# EAGLE design din-rail-distributor (EAGLE 7.3.0)
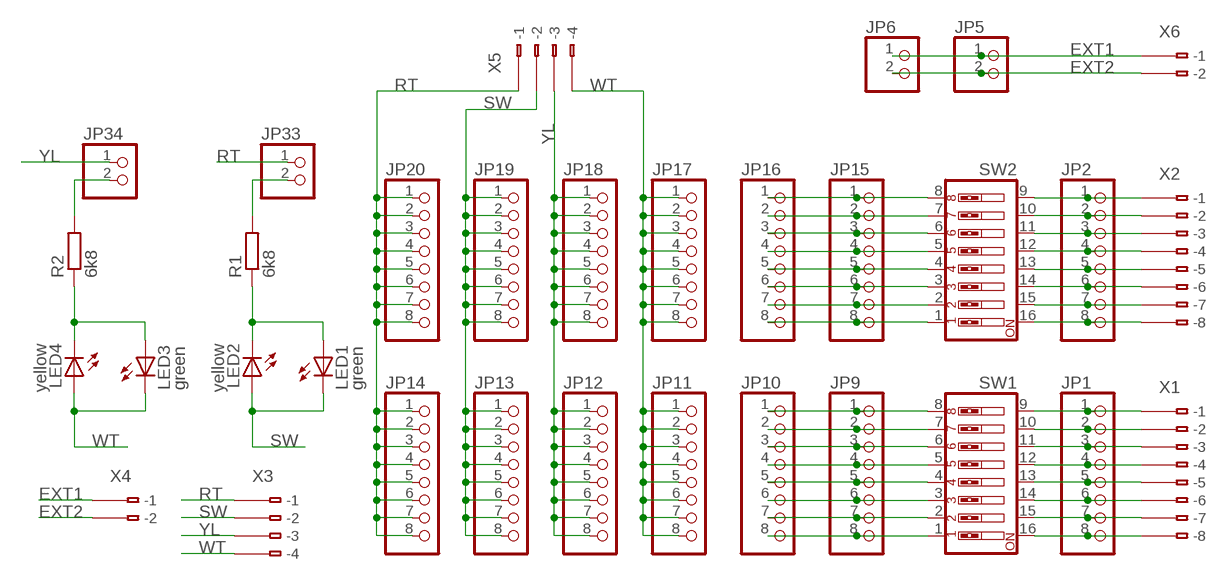
[diagram p0: schematic, sheet 1]

## Parts
JP1  PINHD-1X8  [1X08]
JP2  PINHD-1X8  [1X08]
JP5  PINHD-1X2  [1X02]
JP6  PINHD-1X2  [1X02]
JP9  PINHD-1X8/SMALL  [1X08/SMALL]
JP10  PINHD-1X8/SMALL  [1X08/SMALL]
JP11  PINHD-1X8/SMALL  [1X08/SMALL]
JP12  PINHD-1X8/SMALL  [1X08/SMALL]
JP13  PINHD-1X8/SMALL  [1X08/SMALL]
JP14  PINHD-1X8/SMALL  [1X08/SMALL]
JP15  PINHD-1X8/SMALL  [1X08/SMALL]
JP16  PINHD-1X8/SMALL  [1X08/SMALL]
JP17  PINHD-1X8/SMALL  [1X08/SMALL]
JP18  PINHD-1X8/SMALL  [1X08/SMALL]
JP19  PINHD-1X8/SMALL  [1X08/SMALL]
JP20  PINHD-1X8/SMALL  [1X08/SMALL]
JP33  PINHD-1X2  [1X02]
JP34  PINHD-1X2  [1X02]
LED1  green  LEDCHIP-LED0603  [CHIP-LED0603]
LED2  yellow  LEDCHIP-LED0603  [CHIP-LED0603]
LED3  green  LEDCHIP-LED0603  [CHIP-LED0603]
LED4  yellow  LEDCHIP-LED0603  [CHIP-LED0603]
R1  6k8  R-EU_R1206  [R1206]
R2  6k8  R-EU_R1206  [R1206]
SW1  SW_DIP-8  [EDG-08]
SW2  SW_DIP-8  [EDG-08]
X1  233-108  [233-108]
X2  233-108  [233-108]
X3  233-104  [233-104]
X4  233-102  [233-102]
X5  233-104  [233-104]
X6  233-102  [233-102]

## Nets
EXT1: JP5.1 JP6.1 X4.B1(B-1) X6.B1(B-1)
EXT2: JP5.2 JP6.2 X4.B2(B-2) X6.B2(B-2)
N$1: JP1.8 SW1.16 X1.B8(B-8)
N$2: JP1.7 SW1.15 X1.B7(B-7)
N$3: JP1.6 SW1.14 X1.B6(B-6)
N$4: JP1.5 SW1.13 X1.B5(B-5)
N$5: JP1.4 SW1.12 X1.B4(B-4)
N$6: JP1.3 SW1.11 X1.B3(B-3)
N$7: JP1.2 SW1.10 X1.B2(B-2)
N$8: JP1.1 SW1.9 X1.B1(B-1)
N$9: JP2.8 SW2.16 X2.B8(B-8)
N$10: JP2.7 SW2.15 X2.B7(B-7)
N$11: JP2.6 SW2.14 X2.B6(B-6)
N$12: JP2.5 SW2.13 X2.B5(B-5)
N$13: JP2.4 SW2.12 X2.B4(B-4)
N$14: JP2.3 SW2.11 X2.B3(B-3)
N$15: JP2.2 SW2.10 X2.B2(B-2)
N$16: JP2.1 SW2.9 X2.B1(B-1)
N$49: JP15.1 JP16.1 SW2.8
N$50: JP15.2 JP16.2 SW2.7
N$51: JP15.3 JP16.3 SW2.6
N$52: JP15.4 JP16.4 SW2.5
N$53: JP15.5 JP16.5 SW2.4
N$54: JP15.6 JP16.6 SW2.3
N$55: JP15.7 JP16.7 SW2.2
N$56: JP15.8 JP16.8 SW2.1
N$57: JP9.1 JP10.1 SW1.8
N$58: JP9.2 JP10.2 SW1.7
N$59: JP9.3 JP10.3 SW1.6
N$60: JP9.4 JP10.4 SW1.5
N$61: JP9.5 JP10.5 SW1.4
N$62: JP9.6 JP10.6 SW1.3
N$63: JP9.7 JP10.7 SW1.2
N$64: JP9.8 JP10.8 SW1.1
N$66: JP33.2 R1.2
N$67: LED1.A LED2.C R1.1
N$68: JP34.2 R2.2
N$69: LED3.A LED4.C R2.1
RT: JP14.1 JP14.2 JP14.3 JP14.4 JP14.5 JP14.6 JP14.7 JP14.8 JP20.1 JP20.2 JP20.3 JP20.4 JP20.5 JP20.6 JP20.7 JP20.8 JP33.1 X3.B1(B-1) X5.B1(B-1)
SW: JP13.1 JP13.2 JP13.3 JP13.4 JP13.5 JP13.6 JP13.7 JP13.8 JP19.1 JP19.2 JP19.3 JP19.4 JP19.5 JP19.6 JP19.7 JP19.8 LED1.C LED2.A X3.B2(B-2) X5.B2(B-2)
WT: JP11.1 JP11.2 JP11.3 JP11.4 JP11.5 JP11.6 JP11.7 JP11.8 JP17.1 JP17.2 JP17.3 JP17.4 JP17.5 JP17.6 JP17.7 JP17.8 LED3.C LED4.A X3.B4(B-4) X5.B4(B-4)
YL: JP12.1 JP12.2 JP12.3 JP12.4 JP12.5 JP12.6 JP12.7 JP12.8 JP18.1 JP18.2 JP18.3 JP18.4 JP18.5 JP18.6 JP18.7 JP18.8 JP34.1 X3.B3(B-3) X5.B3(B-3)
Unconnected: X1.A1(-1) X1.A2(-2) X1.A3(-3) X1.A4(-4) X1.A5(-5) X1.A6(-6) X1.A7(-7) X1.A8(-8) X2.A1(-1) X2.A2(-2) X2.A3(-3) X2.A4(-4) X2.A5(-5) X2.A6(-6) X2.A7(-7) X2.A8(-8) X3.A1(-1) X3.A2(-2) X3.A3(-3) X3.A4(-4) X4.A1(-1) X4.A2(-2) X5.A1(-1) X5.A2(-2) X5.A3(-3) X5.A4(-4) X6.A1(-1) X6.A2(-2)

## Library data of the parts
JP1 JP2 JP9-JP20 = pinhead:PINHD-1X8: PIN HEADER
JP5 JP6 JP33 JP34 = pinhead:PINHD-1X2: PIN HEADER
LED1-LED4 = led:LED: LED OSRAM: - CHIPLED LG R971, LG N971, LY N971, LG Q971, LY Q971, LO R971, LY R971 LH N974, LH R974 LS Q976, LO Q976, LY Q976 LO Q996 - Hyper CHIPLED LW Q18S LB Q993, LB Q99A, LB R99A - SideLED LS A670, LO A670, LY A670, LG A670, LP A670 LB A673, LV A673, LT A673, LW A673 LH A674 LY A675 LS A676, LA A676, LO A676, LY A676, LW A676 LS A679, LY A679, LG A679 - Hyper Micro SIDELED® LS Y876, LA Y876, LO Y876, LY Y876 LT Y87S - SmartLED LW L88C, LW L88S LB L89C, LB L89S, LG L890 LS L89K, LO L89K, LY L89K LS L896, LA L896, LO L896, LY L896 - TOPLED LS T670, LO T670, LY T670, LG T670, LP T670 LSG T670, LSP T670, LSY T670, LOP T670, LYG T670 LG T671, LOG T671, LSG T671 LB T673, LV T673, LT T673, LW T673 LH T674 LS T676, LA T676, LO T676, LY T676, LB T676, LH T676, LSB T676, LW T676 LB T67C, LV T67C, LT T67C, LS T67K, LO T67K, LY T67K, LW E67C LS E67B, LA E67B, LO E67B, LY E67B, LB E67C, LV E67C, LT E67C LW T67C LS T679, LY T679, LG T679 LS T770, LO T770, LY T770, LG T770, LP T770 LB T773, LV T773, LT T773, LW T773 LH T774 LS E675, LA E675, LY E675, LS T675 LS T776, LA T776, LO T776, LY T776, LB T776 LHGB T686 LT T68C, LB T68C - Hyper Mini TOPLED® LB M676 - Mini TOPLED Santana® LG M470 LS M47K, LO M47K, LY M47K Source: http://www.osram.convergy.de LUXEON: - LUMILED® LXK2-PW12-R00, LXK2-PW12-S00, LXK2-PW14-U00, LXK2-PW14-V00 LXK2-PM12-R00, LXK2-PM12-S00, LXK2-PM14-U00 LXK2-PE12-Q00, LXK2-PE12-R00, LXK2-PE12-S00, LXK2-PE14-T00, LXK2-PE14-U00 LXK2-PB12-K00, LXK2-PB12-L00, LXK2-PB12-M00, LXK2-PB14-N00, LXK2-PB14-P00, LXK2-PB14-Q00 LXK2-PR12-L00, LXK2-PR12-M00, LXK2-PR14-Q00, LXK2-PR14-R00 LXK2-PD12-Q00, LXK2-PD12-R00, LXK2-PD12-S00 LXK2-PH12-R00, LXK2-PH12-S00 LXK2-PL12-P00, LXK2-PL12-Q00, LXK2-PL12-R00 Source: www.luxeon.com KINGBRIGHT: KA-3528ASYC Source: www.kingbright.com
R1 R2 = rcl:R-EU_: RESISTOR, European symbol
SW1 SW2 = special:SW_DIP-8: DIP SWITCH
X1 X2 = con-wago:233-108: WAGO Cage Clamp; MPN: 233-108; OC_FARNELL: unknown; OC_NEWARK: 28K9050
X3 X5 = con-wago:233-104: WAGO Cage Clamp; MPN: 233-104; OC_FARNELL: unknown; OC_NEWARK: 28K9046
X4 X6 = con-wago:233-102: WAGO Cage Clamp; MPN: 233-102; OC_FARNELL: unknown; OC_NEWARK: 28K9044

## Board
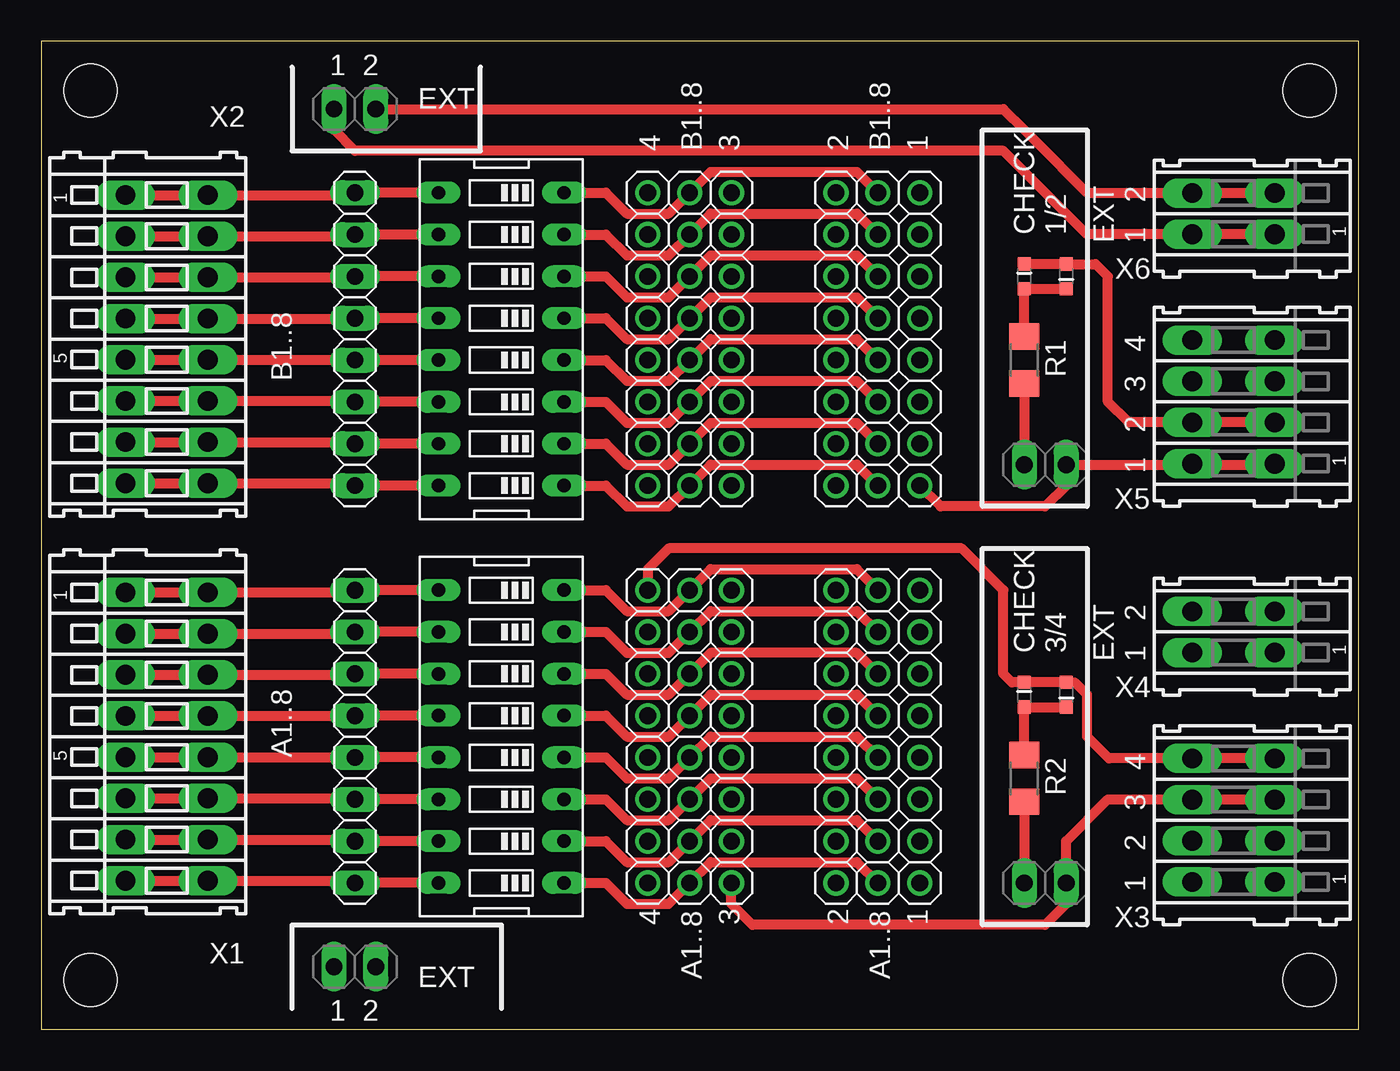
[diagram p1: board, top side]
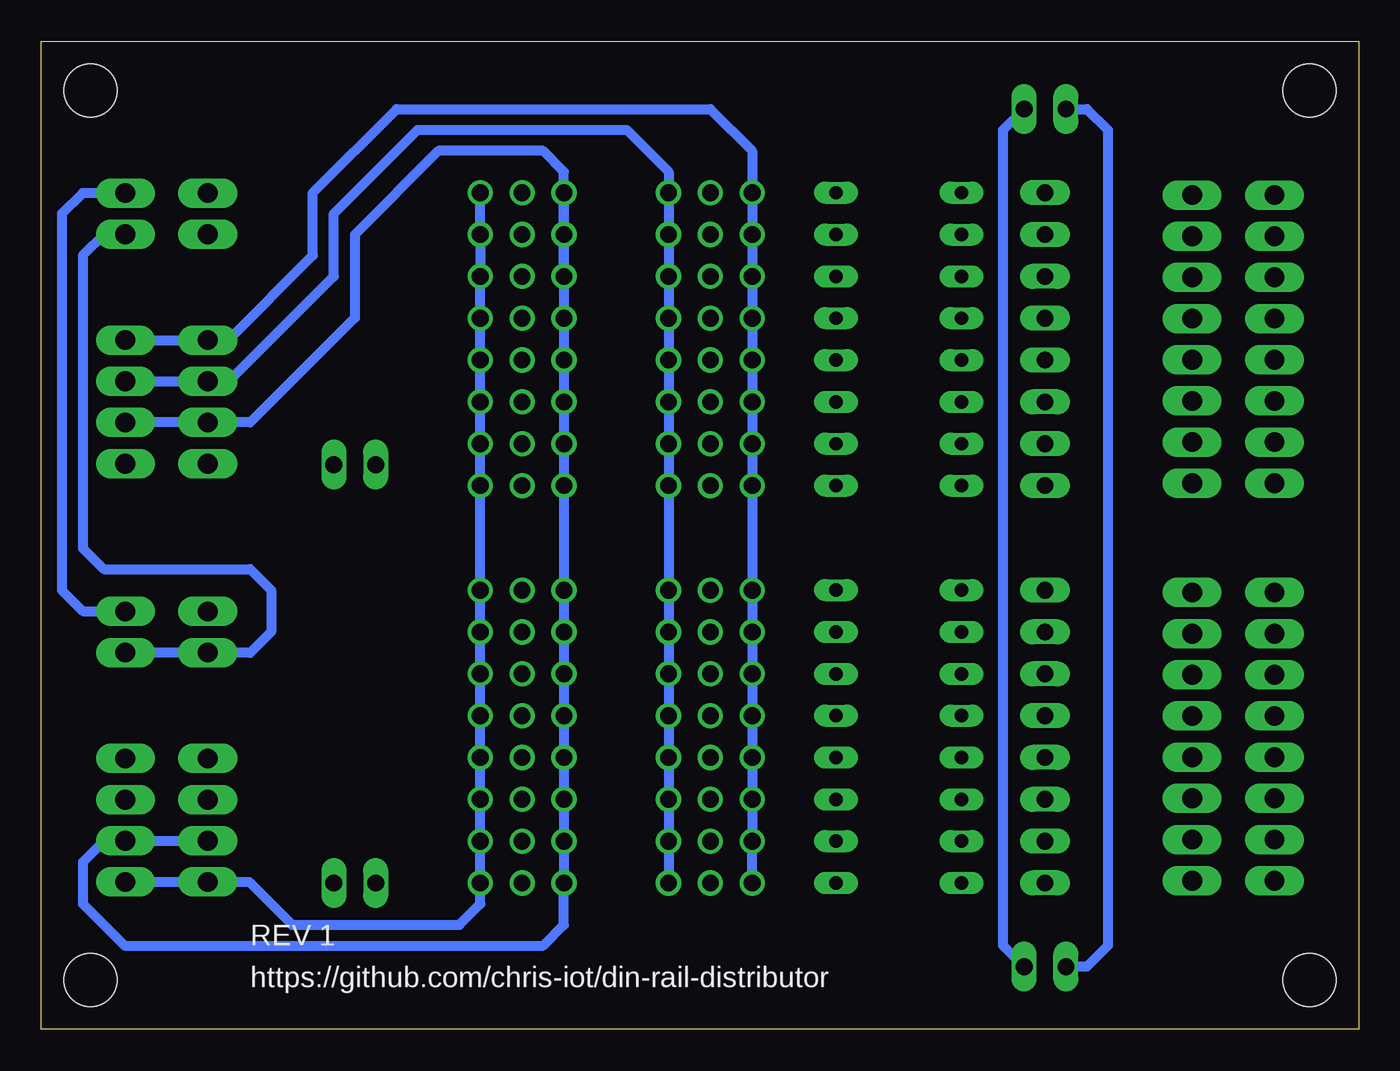
[diagram p2: board, bottom side, seen from below]

Size 80 x 60 mm. Coordinates in mm from the lower left corner, seen from the top.
Outline: 0,0 80,0 80,60 0,60 0,0
Copper layers (1*16): Top 0.035mm / dielectric 1.5mm / Bottom 0.035mm
Design rules "ShenZhen2U_2layer_EagleRules": minimum track width 7mil, minimum drill 12mil, track to track 7mil, track to pad 7mil, pad to pad 7mil, via to via 7mil, smd to smd 0mil, copper to edge 20mil, drill to drill 10mil, minimum pad ring 10mil, minimum via ring 6mil, stop-mask expansion 2mil, vias tented up to drill 25mil, thermal gap 10mil
Holes 3.2 mm at 3,57 3,3 77,3 77,57

### Footprints (pad centres in the part's own frame; a part is rotated, then mirrored left to right if it is on the bottom)
1X08 = drill 1.016 long: 1 -8.89,0; 2 -6.35,0; 3 -3.81,0; 4 -1.27,0; 5 1.27,0; 6 3.81,0; 7 6.35,0; 8 8.89,0
1X02 = drill 1.016 long: 1 -1.27,0; 2 1.27,0
1X08/SMALL = drill 1.016: 1 1.27,1.27; 2 3.81,1.27; 3 6.35,1.27; 4 8.89,1.27; 5 11.43,1.27; 6 13.97,1.27; 7 16.51,1.27; 8 19.05,1.27
CHIP-LED0603 = smd 0.8 x 0.8: A 0,-0.75; C 0,0.75
R1206 = smd 1.6 x 1.803: 1 -1.422,0; 2 1.422,0
EDG-08 = drill 0.813 long: 1 -8.89,-3.81; 2 -6.35,-3.81; 3 -3.81,-3.81; 4 -1.27,-3.81; 5 1.27,-3.81; 6 3.81,-3.81; 7 6.35,-3.81; 8 8.89,-3.81; 9 8.89,3.81; 10 6.35,3.81; 11 3.81,3.81; 12 1.27,3.81; 13 -1.27,3.81; 14 -3.81,3.81; 15 -6.35,3.81; 16 -8.89,3.81
233-108 = drill 1.2 long: A1 -8.75,2.5; A2 -6.25,2.5; A3 -3.75,2.5; A4 -1.25,2.5; A5 1.25,2.5; A6 3.75,2.5; A7 6.25,2.5; A8 8.75,2.5; B1 -8.75,-2.5; B2 -6.25,-2.5; B3 -3.75,-2.5; B4 -1.25,-2.5; B5 1.25,-2.5; B6 3.75,-2.5; B7 6.25,-2.5; B8 8.75,-2.5
233-104 = drill 1.2 long: A1 -3.75,2.5; A2 -1.25,2.5; A3 1.25,2.5; A4 3.75,2.5; B1 -3.75,-2.5; B2 -1.25,-2.5; B3 1.25,-2.5; B4 3.75,-2.5
233-102 = drill 1.2 long: A1 -1.25,2.5; A2 1.25,2.5; B1 -1.25,-2.5; B2 1.25,-2.5

### Placement (x,y rotation side)
JP1  19.05,17.78 270 top
JP2  19.05,41.91 270 top
JP5  19.05,55.88 0 top
JP6  19.05,3.81 0 top
JP9  38.1,27.94 270 top
JP10  49.53,27.94 270 top
JP11  35.56,27.94 270 top
JP12  40.64,27.94 270 top
JP13  46.99,27.94 270 top
JP14  52.07,27.94 270 top
JP15  38.1,52.07 270 top
JP16  49.53,52.07 270 top
JP17  35.56,52.07 270 top
JP18  40.64,52.07 270 top
JP19  46.99,52.07 270 top
JP20  52.07,52.07 270 top
JP33  60.96,34.29 180 top
JP34  60.96,8.89 180 top
LED1  59.69,45.72 0 top
LED2  62.23,45.72 180 top
LED3  59.69,20.32 0 top
LED4  62.23,20.32 180 top
R1  59.69,40.64 270 top
R2  59.69,15.24 270 top
SW1  27.94,17.78 90 top
SW2  27.94,41.91 90 top
X1  7.62,17.78 270 top
X2  7.62,41.91 270 top
X3  72.39,12.7 90 top
X4  72.39,24.13 90 top
X5  72.39,38.1 90 top
X6  72.39,49.53 90 top

### Tracks (layer width: path | path; a pad name or v marks a point on that pad's centre or on a via)
EXT1
  Top 0.61: X6.B1 63.48,48.28 58.42,53.34 19.05,53.34 17.78,54.61 JP5.1
  Bottom 0.61: JP5.1 16.51,55.88 15.24,54.61 15.24,5.08 16.51,3.81 JP6.1 | X6.B1 76.18,48.28 77.47,46.99 77.47,29.21 76.2,27.94 67.31,27.94 66.04,26.67 66.04,24.13 67.31,22.86 74.87,22.86 X4.B1
EXT2
  Top 0.61: X6.B2 63.52,50.78 60.33,53.98 59.69,54.61 58.42,55.88 JP5.2
  Bottom 0.61: JP6.2 21.59,5.08 21.59,54.61 JP5.2 | X6.B2 77.49,50.78 78.74,49.53 78.74,26.67 77.47,25.4 74.91,25.4 X4.B2
N$1
  Top 0.61: X1.B8 18.91,9.03 JP1.8 SW1.16
N$2
  Top 0.61: X1.B7 18.95,11.53 JP1.7 SW1.15
N$3
  Top 0.61: X1.B6 18.99,14.03 JP1.6 SW1.14
N$4
  Top 0.61: X1.B5 19.03,16.53 JP1.5 SW1.13
N$5
  Top 0.61: X1.B4 19.03,19.03 JP1.4 SW1.12
N$6
  Top 0.61: X1.B3 18.99,21.53 JP1.3 SW1.11
N$7
  Top 0.61: X1.B2 18.95,24.03 JP1.2 SW1.10
N$8
  Top 0.61: X1.B1 18.91,26.53 JP1.1 SW1.9
N$9
  Top 0.61: X2.B8 19.05,33.16 JP2.8 SW2.16
N$10
  Top 0.61: X2.B7 19.05,35.66 JP2.7 SW2.15
N$11
  Top 0.61: X2.B6 19.05,38.16 JP2.6 SW2.14
N$12
  Top 0.61: X2.B5 19.05,40.66 JP2.5 SW2.13
N$13
  Top 0.61: X2.B4 19.05,43.16 JP2.4 SW2.12
N$14
  Top 0.61: X2.B3 19.05,45.66 JP2.3 SW2.11
N$15
  Top 0.61: X2.B2 19.05,48.16 JP2.2 SW2.10
N$16
  Top 0.61: X2.B1 19.05,50.66 JP2.1 SW2.9
N$49
  Top 0.61: SW2.8 34.29,50.8 35.56,49.53 38.1,49.53 JP15.1 40.64,52.07 49.53,52.07 JP16.1
N$50
  Top 0.61: SW2.7 34.29,48.26 35.56,46.99 38.1,46.99 JP15.2 40.64,49.53 49.53,49.53 JP16.2
N$51
  Top 0.61: SW2.6 34.29,45.72 35.56,44.45 38.1,44.45 JP15.3 40.64,46.99 49.53,46.99 JP16.3
N$52
  Top 0.61: SW2.5 34.29,43.18 35.56,41.91 38.1,41.91 JP15.4 40.64,44.45 49.53,44.45 JP16.4
N$53
  Top 0.61: SW2.4 34.29,40.64 35.56,39.37 38.1,39.37 JP15.5 40.64,41.91 49.53,41.91 JP16.5
N$54
  Top 0.61: SW2.3 34.29,38.1 35.56,36.83 38.1,36.83 JP15.6 40.64,39.37 49.53,39.37 JP16.6
N$55
  Top 0.61: SW2.2 34.29,35.56 35.56,34.29 38.1,34.29 JP15.7 40.64,36.83 49.53,36.83 JP16.7
N$56
  Top 0.61: SW2.1 34.29,33.02 35.56,31.75 38.1,31.75 JP15.8 40.64,34.29 49.53,34.29 JP16.8
N$57
  Top 0.61: SW1.8 34.29,26.67 35.56,25.4 38.1,25.4 JP9.1 40.64,27.94 49.53,27.94 JP10.1
N$58
  Top 0.61: SW1.7 34.29,24.13 35.56,22.86 38.1,22.86 JP9.2 40.64,25.4 49.53,25.4 JP10.2
N$59
  Top 0.61: SW1.6 34.29,21.59 35.56,20.32 38.1,20.32 JP9.3 40.64,22.86 49.53,22.86 JP10.3
N$60
  Top 0.61: SW1.5 34.29,19.05 35.56,17.78 38.1,17.78 JP9.4 40.64,20.32 49.53,20.32 JP10.4
N$61
  Top 0.61: SW1.4 34.29,16.51 35.56,15.24 38.1,15.24 JP9.5 40.64,17.78 49.53,17.78 JP10.5
N$62
  Top 0.61: SW1.3 34.29,13.97 35.56,12.7 38.1,12.7 JP9.6 40.64,15.24 49.53,15.24 JP10.6
N$63
  Top 0.61: SW1.2 34.29,11.43 35.56,10.16 38.1,10.16 JP9.7 40.64,12.7 49.53,12.7 JP10.7
N$64
  Top 0.61: SW1.1 34.29,8.89 35.56,7.62 38.1,7.62 JP9.8 40.64,10.16 49.53,10.16 JP10.8
N$66
  Top 0.61: R1.2 JP33.2
N$67
  Top 0.61: R1.1 LED1.A LED2.C
N$68
  Top 0.61: R2.2 JP34.2
N$69
  Top 0.61: R2.1 LED3.A LED4.C
RT
  Top 0.61: X5.B1 74.83,34.29 JP33.1 62.23,33.02 60.96,31.75 54.61,31.75 JP20.8
  Bottom 0.61: JP20.1 JP20.2 JP20.3 JP20.4 JP20.5 JP20.6 JP20.7 JP20.8 JP14.1 JP14.2 JP14.3 JP14.4 JP14.5 JP14.6 JP14.7 JP14.8 53.34,7.62 54.61,6.35 64.77,6.35 67.37,8.95 X3.B1
SW
  Top 0.61: LED1.C LED2.A 64.02,46.47 64.77,45.72 64.77,38.1 66.02,36.85 X5.B2
  Bottom 0.61: JP19.1 JP19.2 JP19.3 | JP19.3 JP19.4 JP19.5 JP19.6 JP19.7 JP19.8 JP13.1 JP13.2 JP13.3 JP13.4 JP13.5 JP13.6 JP13.7 JP13.8 48.26,6.35 49.53,5.08 74.93,5.08 77.47,7.62 77.47,10.16 76.2,11.43 69.85,11.43 69.87,11.45 X3.B2 | JP19.3 48.26,52.07 49.53,53.34 55.88,53.34 60.96,48.26 60.96,43.2 67.31,36.85 X5.B2
WT
  Top 0.61: X3.B4 64.83,16.45 63.5,17.78 63.5,20.32 62.75,21.07 LED4.A LED3.C 58.94,21.07 58.42,21.59 58.42,26.67 55.88,29.21 38.1,29.21 36.83,27.94 JP11.1
  Bottom 0.61: JP11.8 JP11.7 JP11.6 JP11.5 JP11.4 JP11.3 JP11.2 JP11.1 JP17.8 JP17.7 JP17.6 JP17.5 JP17.4 JP17.3 JP17.2 JP17.1 36.83,53.34 39.37,55.88 58.42,55.88 63.5,50.8 63.5,46.99 68.64,41.85 X5.B4
YL
  Top 0.61: X3.B3 74.87,13.97 64.77,13.97 62.23,11.43 JP34.1 62.23,7.62 60.96,6.35 43.18,6.35 41.91,7.62 JP12.8
  Bottom 0.61: JP12.8 JP12.7 JP12.6 JP12.5 JP12.4 JP12.3 JP12.2 JP12.1 JP18.8 JP18.7 JP18.6 JP18.5 JP18.4 JP18.3 JP18.2 JP18.1 41.91,52.07 44.45,54.61 57.15,54.61 62.23,49.53 62.23,45.72 68.6,39.35 X5.B3

### Text on the board
tNames: 1 2 | EXT | 4 | B1..8 | 3 | 2 | B1..8 | 1 | CHECK / 1/2 | EXT / 1 2 | B1..8 | 1 2 3 4 | CHECK / 3/4 | EXT / 1 2 | A1..8 | 1 2 3 4 | 4 | 3 | 2 | 1 | EXT | A1..8 | A1..8 | 1 2
bNames: REV 1 | https://github.com/chris-iot/din-rail-distributor